# EAGLE schematic Schematic (EAGLE 8.3.1)
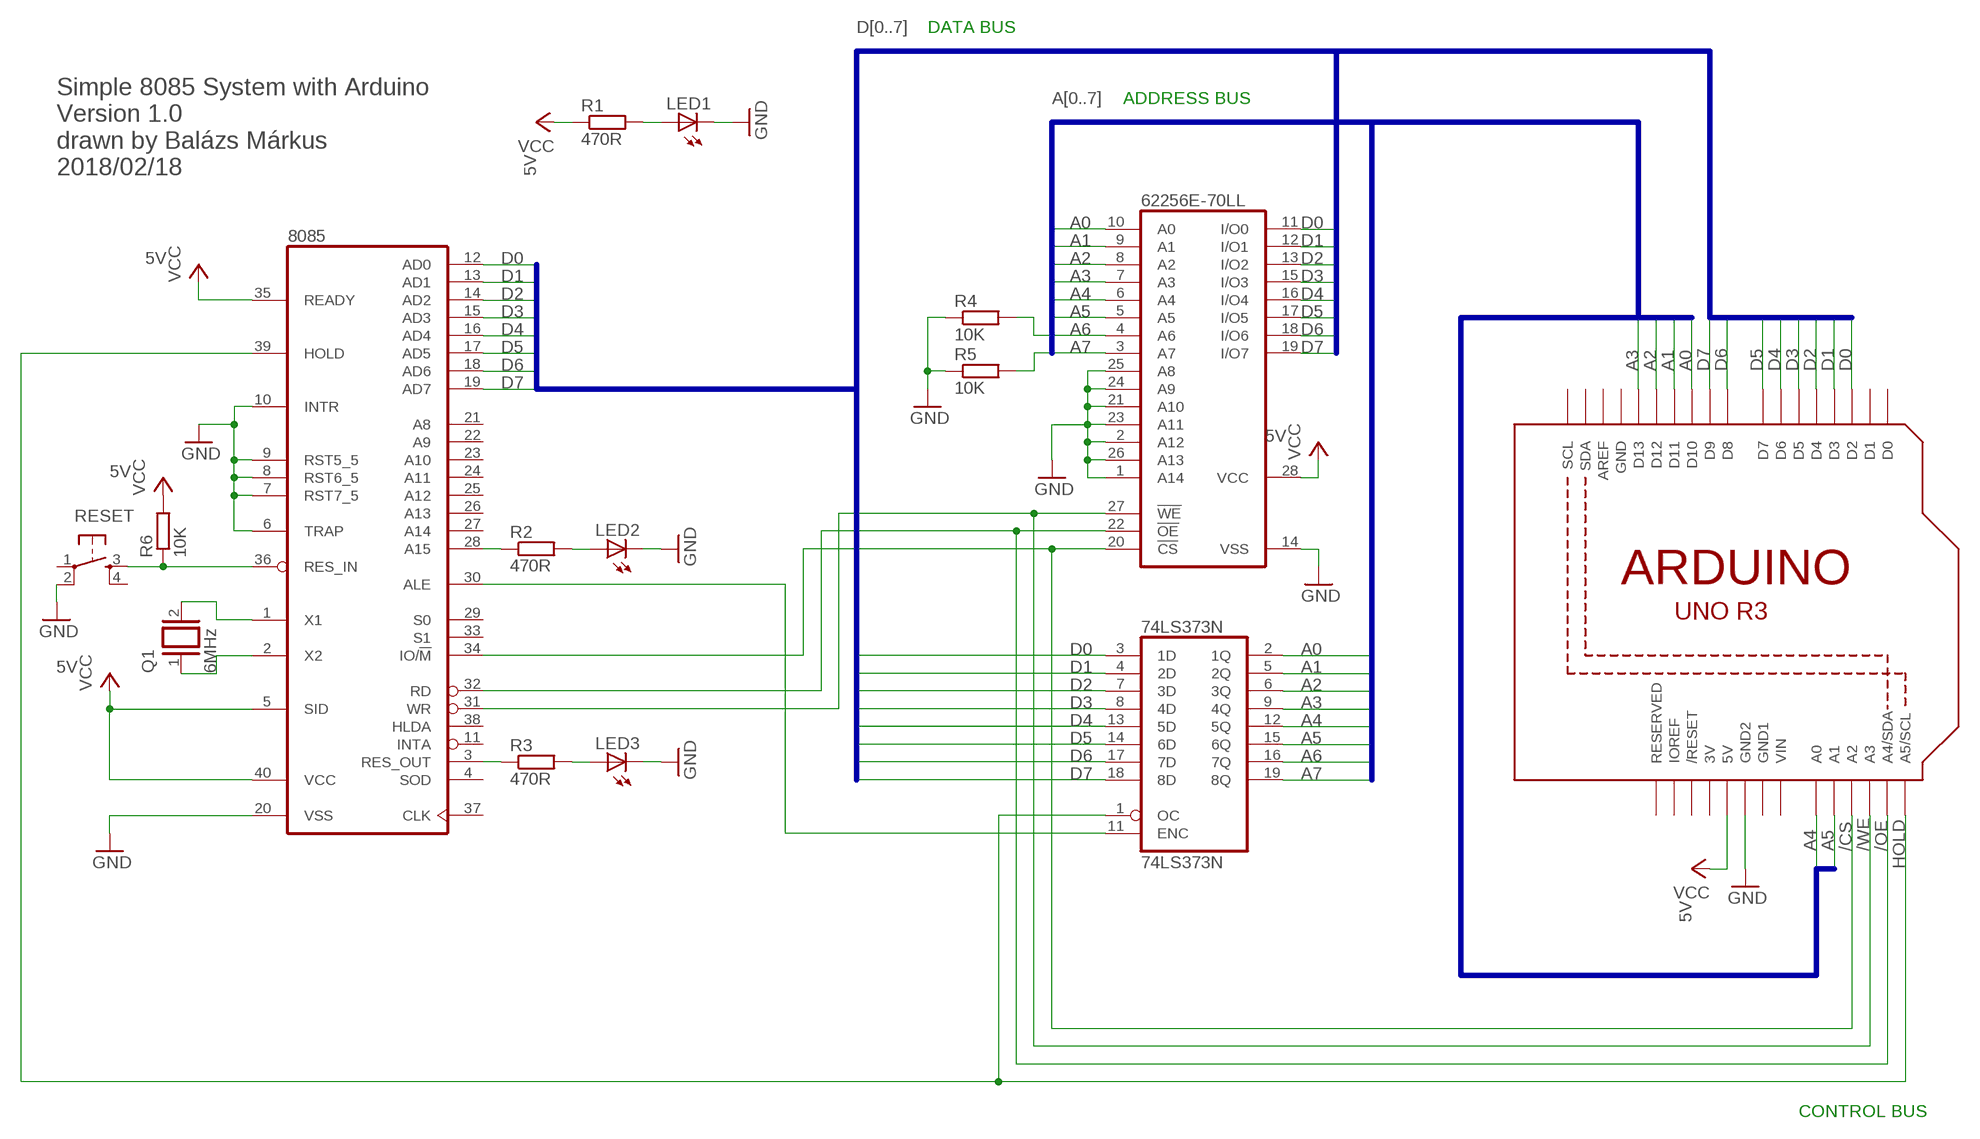
[diagram p0: schematic, sheet 1]

## Parts
74LS373N  74LS373N  [DIL20]
8085  8085  [DIL40]
62256E-70LL  62256P  [DIL28-6]
ARDUINO  ARDUINOR3-BPLACE  [ARDUINOR3-BPLACE]
LED1  LED5MM  [LED5MM]
LED2  LED5MM  [LED5MM]
LED3  LED5MM  [LED5MM]
Q1  6MHz  XTAL  [Q]
R1  470R  R-EU_0207/5V  [0207/5V]
R2  470R  R-EU_0207/5V  [0207/5V]
R3  470R  R-EU_0207/5V  [0207/5V]
R4  10K  R-EU_0207/5V  [0207/5V]
R5  10K  R-EU_0207/5V  [0207/5V]
R6  10K  R-EU_0207/5V  [0207/5V]
RESET  TAC_SWITCHPTH  [TACTILE-PTH]

## Nets
/CS: 8085.34(IO/!M) 62256E-70LL.20(!CS) ARDUINO.A2
/OE: 8085.32(RD) 62256E-70LL.22(!OE) ARDUINO.A4(A4/SDA)
/WE: 8085.31(WR) 62256E-70LL.27(!WE) ARDUINO.A3
A0: 74LS373N.2(1Q) 62256E-70LL.10(A0) ARDUINO.D10
A1: 74LS373N.5(2Q) 62256E-70LL.9(A1) ARDUINO.D11
A2: 74LS373N.6(3Q) 62256E-70LL.8(A2) ARDUINO.D12
A3: 74LS373N.9(4Q) 62256E-70LL.7(A3) ARDUINO.D13
A4: 74LS373N.12(5Q) 62256E-70LL.6(A4) ARDUINO.A0
A5: 74LS373N.15(6Q) 62256E-70LL.5(A5) ARDUINO.A1
A6: 74LS373N.16(7Q) 62256E-70LL.4(A6) R4.2
A7: 74LS373N.19(8Q) 62256E-70LL.3(A7) R5.2
D0: 74LS373N.3(1D) 8085.12(AD0) 62256E-70LL.11(I/O0) ARDUINO.D2
D1: 74LS373N.4(2D) 8085.13(AD1) 62256E-70LL.12(I/O1) ARDUINO.D3
D2: 74LS373N.7(3D) 8085.14(AD2) 62256E-70LL.13(I/O2) ARDUINO.D4
D3: 74LS373N.8(4D) 8085.15(AD3) 62256E-70LL.15(I/O3) ARDUINO.D5
D4: 74LS373N.13(5D) 8085.16(AD4) 62256E-70LL.16(I/O4) ARDUINO.D6
D5: 74LS373N.14(6D) 8085.17(AD5) 62256E-70LL.17(I/O5) ARDUINO.D7
D6: 74LS373N.17(7D) 8085.18(AD6) 62256E-70LL.18(I/O6) ARDUINO.D8
D7: 74LS373N.18(8D) 8085.19(AD7) 62256E-70LL.19(I/O7) ARDUINO.D9
GND: 8085.6(TRAP) 8085.7(RST7_5) 8085.8(RST6_5) 8085.9(RST5_5) 8085.10(INTR) 8085.20(VSS) 62256E-70LL.1(A14) 62256E-70LL.2(A12) 62256E-70LL.14(VSS) 62256E-70LL.21(A10) 62256E-70LL.23(A11) 62256E-70LL.24(A9) 62256E-70LL.25(A8) 62256E-70LL.26(A13) ARDUINO.GND2 LED1.K(C) LED2.K(C) LED3.K(C) R4.1 R5.1 RESET.2
HOLD: 74LS373N.1(OC) 8085.39(HOLD) ARDUINO.A5(A5/SCL)
N$1: 8085.1(X1) Q1.2
N$2: 8085.2(X2) Q1.1
N$3: 8085.36(RES_IN) R6.1 RESET.3
N$6: 74LS373N.11(ENC) 8085.30(ALE)
N$7: 8085.28(A15) R2.1
N$8: LED2.A R2.2
N$9: 8085.3(RES_OUT) R3.1
N$11: LED3.A R3.2
N$12: LED1.A R1.2
VCC: 8085.5(SID) 8085.35(READY) 8085.40(VCC) 62256E-70LL.28(VCC) ARDUINO.5V R1.1 R6.2
Unconnected: 8085.4(SOD) 8085.11(INTA) 8085.21(A8) 8085.22(A9) 8085.23(A10) 8085.24(A11) 8085.25(A12) 8085.26(A13) 8085.27(A14) 8085.29(S0) 8085.33(S1) 8085.37(CLK) 8085.38(HLDA) ARDUINO.AREF ARDUINO.D0 ARDUINO.D1 ARDUINO.IOREF ARDUINO.RESERVED ARDUINO.RESET(/RESET) ARDUINO.SCL ARDUINO.SDA RESET.1 RESET.4

## Buses
D[0..7]
A[0..7]

## Notes on the sheet
- DATA BUS
- ADDRESS BUS
- Simple 8085 System with Arduino
  Version 1.0
  drawn by Balázs Márkus
  2018/02/18
- CONTROL BUS

## Power pins joined to a net without a drawn wire
3V: ARDUINO.3V
GND: 74LS373N.10(GND) ARDUINO.GND
GND1: ARDUINO.GND1
VCC: 74LS373N.20(VCC)
VIN: ARDUINO.VIN

## Library data of the parts
74LS373N = 74xx-eu:74*373: Octal D type transparent LATCH, edge triggered
8085 = micro-intel:8085: MICROCOMPUTER/PERIPHERAL DEVICE; OC_FARNELL: unknown; OC_NEWARK: unknown
62256E-70LL = memory-hitachi:62256P: MEMORY; OC_FARNELL: unknown; OC_NEWARK: unknown
ARDUINO = adafruit:ARDUINOR3: This is a new object for the new Arduino R3 - with extra pins that you may want to use (such as IOref, and duplicated A4/A5
LED1-LED3 = adafruit:LED: LED OSRAM: - CHIPLED LG R971, LG N971, LY N971, LG Q971, LY Q971, LO R971, LY R971 LH N974, LH R974 LS Q976, LO Q976, LY Q976 LO Q996 - Hyper CHIPLED LW Q18S LB Q993, LB Q99A, LB R99A - SideLED LS A670, LO A670, LY A670, LG A670, LP A670 LB A673, LV A673, LT A673, LW A673 LH A674 LY A675 LS A676, LA A676, LO A676, LY A676, LW A676 LS A679, LY A679, LG A679 - Hyper Micro SIDELED® LS Y876, LA Y876, LO Y876, LY Y876 LT Y87S - SmartLED LW L88C, LW L88S LB L89C, LB L89S, LG L890 LS L89K, LO L89K, LY L89K LS L896, LA L896, LO L896, LY L896 - TOPLED LS T670, LO T670, LY T670, LG T670, LP T670 LSG T670, LSP T670, LSY T670, LOP T670, LYG T670 LG T671, LOG T671, LSG T671 LB T673, LV T673, LT T673, LW T673 LH T674 LS T676, LA T676, LO T676, LY T676, LB T676, LH T676, LSB T676, LW T676 LB T67C, LV T67C, LT T67C, LS T67K, LO T67K, LY T67K, LW E67C LS E67B, LA E67B, LO E67B, LY E67B, LB E67C, LV E67C, LT E67C LW T67C LS T679, LY T679, LG T679 LS T770, LO T770, LY T770, LG T770, LP T770 LB T773, LV T773, LT T773, LW T773 LH T774 LS E675, LA E675, LY E675, LS T675 LS T776, LA T776, LO T776, LY T776, LB T776 LHGB T686 LT T68C, LB T68C - Hyper Mini TOPLED® LB M676 - Mini TOPLED Santana® LG M470 LS M47K, LO M47K, LY M47K Source: http://www.osram.convergy.de/
Q1 = special:XTAL: CRYSTAL
R1-R6 = resistor:R-EU_: RESISTOR, European symbol
RESET = SparkFun-Retired:TAC_SWITCH: Momentary Switch Button commonly used for reset or general input. Spark Fun Electronics SKU : COM-00097 SMT- SWCH-08247